# Altium schematic sheet ADC_Level.SchDoc
size A4
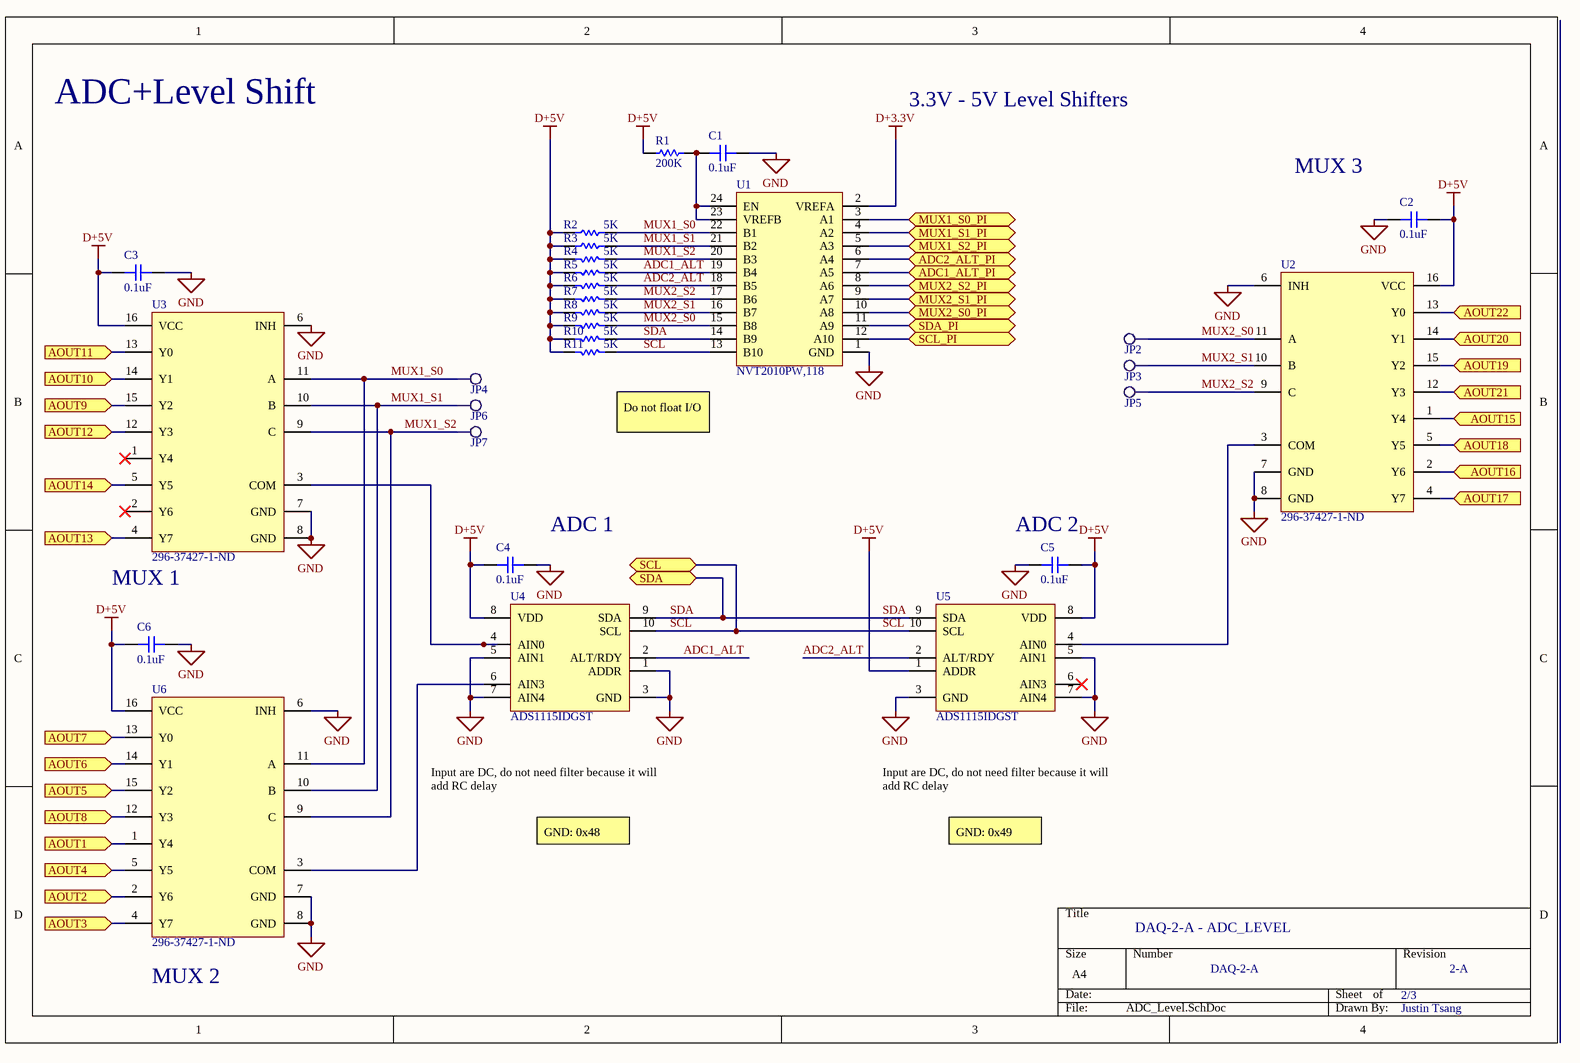
[diagram p0: ADC_Level.SchDoc]

## Parts
C1  0.1uF  [CAP-0603]
C2  0.1uF  [CAP-0603]
C3  0.1uF  [CAP-0603]
C4  0.1uF  [CAP-0603]
C5  0.1uF  [CAP-0603]
C6  0.1uF  [CAP-0603]
JP2  Testpoint2  [TP2]  (value not drawn)
JP3  Testpoint2  [TP2]  (value not drawn)
JP4  Testpoint2  [TP2]  (value not drawn)
JP5  Testpoint2  [TP2]  (value not drawn)
JP6  Testpoint2  [TP2]  (value not drawn)
JP7  Testpoint2  [TP2]  (value not drawn)
R1  200K  [RES-0603]
R2  5K  [RES-0603]
R3  5K  [RES-0603]
R4  5K  [RES-0603]
R5  5K  [RES-0603]
R6  5K  [RES-0603]
R7  5K  [RES-0603]
R8  5K  [RES-0603]
R9  5K  [RES-0603]
R10  5K  [RES-0603]
R11  5K  [RES-0603]
U1  NVT2010PW,118  [TSSOP65P660X110-24]
U2  296-37427-1-ND  [16-SOIC]
U3  296-37427-1-ND  [16-SOIC]
U4  ADS1115IDGST  [VSSOP50P310X310-10P]
U5  ADS1115IDGST  [VSSOP50P310X310-10P]
U6  296-37427-1-ND  [16-SOIC]

## Ports
ADC1_ALT_PI (bidir), ADC2_ALT_PI (bidir), AOUT1 (in), AOUT2 (in), AOUT3 (in), AOUT4 (in), AOUT5 (in), AOUT6 (in), AOUT7 (in), AOUT8 (in), AOUT9 (in), AOUT10 (in), AOUT11 (in), AOUT12 (in), AOUT13 (in), AOUT14 (in), AOUT15 (in), AOUT16 (in), AOUT17 (in), AOUT18 (in), AOUT19 (in), AOUT20 (in), AOUT21 (in), AOUT22 (in), MUX1_S0_PI (bidir), MUX1_S1_PI (bidir), MUX1_S2_PI (bidir), MUX2_S0_PI (bidir), MUX2_S1_PI (bidir), MUX2_S2_PI (bidir), SCL (bidir), SCL_PI (bidir), SDA (bidir), SDA_PI (bidir)

## Nets
D+3.3V: U1.2(VREFA)
D+5V: C2.2 C3.2 C4.2 C5.2 C6.2 R1.2 R2.1 R3.1 R4.1 R5.1 R6.1 R7.1 R8.1 R9.1 R10.2 R11.1 U2.16(VCC) U3.16(VCC) U4.8(VDD) U5.1(ADDR) U5.8(VDD) U6.16(VCC)
GND: C1.1 C2.1 C3.1 C4.1 C5.1 C6.1 U1.1(GND) U2.6(INH) U2.7(GND) U2.8(GND) U3.6(INH) U3.7(GND) U3.8(GND) U4.1(ADDR) U4.3(GND) U4.5(AIN1) U4.7(AIN4) U5.3(GND) U5.5(AIN1) U5.7(AIN4) U6.6(INH) U6.7(GND) U6.8(GND)
ADC1_ALT: R5.2 U1.19(B4) U4.2(ALT/RDY)
ADC1_ALT_PI: U1.7(A5) ; port ADC1_ALT_PI
ADC2_ALT: R6.2 U1.18(B5) U5.2(ALT/RDY)
ADC2_ALT_PI: U1.6(A4) ; port ADC2_ALT_PI
AOUT1: U6.1(Y4) ; port AOUT1
AOUT2: U6.2(Y6) ; port AOUT2
AOUT3: U6.4(Y7) ; port AOUT3
AOUT4: U6.5(Y5) ; port AOUT4
AOUT5: U6.15(Y2) ; port AOUT5
AOUT6: U6.14(Y1) ; port AOUT6
AOUT7: U6.13(Y0) ; port AOUT7
AOUT8: U6.12(Y3) ; port AOUT8
AOUT9: U3.15(Y2) ; port AOUT9
AOUT10: U3.14(Y1) ; port AOUT10
AOUT11: U3.13(Y0) ; port AOUT11
AOUT12: U3.12(Y3) ; port AOUT12
AOUT13: U3.4(Y7) ; port AOUT13
AOUT14: U3.5(Y5) ; port AOUT14
AOUT15: U2.1(Y4) ; port AOUT15
AOUT16: U2.2(Y6) ; port AOUT16
AOUT17: U2.4(Y7) ; port AOUT17
AOUT18: U2.5(Y5) ; port AOUT18
AOUT19: U2.15(Y2) ; port AOUT19
AOUT20: U2.14(Y1) ; port AOUT20
AOUT21: U2.12(Y3) ; port AOUT21
AOUT22: U2.13(Y0) ; port AOUT22
MUX1_S0: JP4.1 R2.2 U1.22(B1) U3.11(A) U6.11(A)
MUX1_S0_PI: U1.3(A1) ; port MUX1_S0_PI
MUX1_S1: JP6.1 R3.2 U1.21(B2) U3.10(B) U6.10(B)
MUX1_S1_PI: U1.4(A2) ; port MUX1_S1_PI
MUX1_S2: JP7.1 R4.2 U1.20(B3) U3.9(C) U6.9(C)
MUX1_S2_PI: U1.5(A3) ; port MUX1_S2_PI
MUX2_S0: JP2.1 R9.2 U1.15(B8) U2.11(A)
MUX2_S0_PI: U1.10(A8) ; port MUX2_S0_PI
MUX2_S1: JP3.1 R8.2 U1.16(B7) U2.10(B)
MUX2_S1_PI: U1.9(A7) ; port MUX2_S1_PI
MUX2_S2: JP5.1 R7.2 U1.17(B6) U2.9(C)
MUX2_S2_PI: U1.8(A6) ; port MUX2_S2_PI
SCL: R11.2 U1.13(B10) U4.10(SCL) U5.10(SCL) ; port SCL
SCL_PI: U1.12(A10) ; port SCL_PI
SDA: R10.1 U1.14(B9) U4.9(SDA) U5.9(SDA) ; port SDA
SDA_PI: U1.11(A9) ; port SDA_PI
NetC1_2: C1.2 R1.1 U1.23(VREFB) U1.24(EN)
NetU2_3: U2.3(COM) U5.4(AIN0)
NetU3_3: U3.3(COM) U4.4(AIN0)
NetU4_6: U4.6(AIN3) U6.3(COM)

Not connected (* = marked no-connect by the designer): U3 1(Y4)* 2(Y6)*; U5 6(AIN3)*

## Notes on the sheet
- ADC+Level Shift
- 3.3V - 5V Level Shifters
- MUX 3
- Do not float I/O
- (near U3) MUX 1
- (near C4) ADC 1
- (near C5) ADC 2
- Input are DC, do not need filter because it will add RC delay
- GND: 0x48
- GND: 0x49
- DAQ-2-A - ADC_LEVEL
- (near U6) MUX 2
- DAQ-2-A
- 2/3
- 2-A
- Justin Tsang

## Library data of the parts
C1-C6 = 0603-0.1uF-16V: CAP CER 0.1UF 16V X7R 0603; Manufacturer: KEMET; Manufacturer Part Number: C0603C104M4RACTU; Dielectric Material: Ceramic; Capacitance: 100nF; Tolerance: 20%; Supplier 1: Digi-Key; Stock 1: 254524; Pricing 1: 1=0.1, 10=0.036, 100=0.0161, 500=0.01152, 1000=0.00904 (USD); Mount: Surface Mount,PCB; Case/Package: 0603; Number of Pins: 2; Case Code (Metric): 1608; Case Code (Imperial): 0603; Min Operating Temperature: -55°C; Max Operating Temperature: 125°C; Package Quantity: 1; Voltage Rating: 16V; Packaging: Tape and Reel; Voltage Rating (DC): 16V; Dielectric: X7R; Termination: SMD/SMT; Length: 1.6mm; Height: 0.8mm; Width: 0.031inch; Thickness: 0.034inch; Lead Pitch: 0.7mm; Depth: 0.8mm; Radiation Hardening: No; REACH SVHC: No SVHC; ComponentLink1URL: https://www.verical.com/server-webapp/html/getDatasheet?partID=66190&src-supplier=Verical; ComponentLink1Description: https://www.verical.com/server-webapp/html/getDatasheet?partID=66190&src-supplier=Verical; ComponentLink2URL: http://www.farnell.com/datasheets/2746055.pdf?src-supplier=Element14; ComponentLink2Description: http://www.farnell.com/datasheets/2746055.pdf?src-supplier=Element14; ComponentLink3URL: http://www.farnell.com/datasheets/2123765.pdf?src-supplier=Element14; ComponentLink3Description: http://www.farnell.com/datasheets/2123765.pdf?src-supplier=Element14; ComponentLink4URL: http://www.alliedelec.com/m/d/9bfe7773041ffe9d406e68bc7b377fdd.pdf?src-supplier=Allied+Electronics; ComponentLink4Description: http://www.alliedelec.com/m/d/9bfe7773041ffe9d406e68bc7b377fdd.pdf?src-supplier=Allied+Electronics; ComponentLink5URL: https://www.verical.com/server-webapp/html/getDatasheet?partID=302288&src-supplier=Verical; ComponentLink5Description: https://www.verical.com/server-webapp/html/getDatasheet?partID=302288&src-supplier=Verical; Supplier Part Number 1: 399-1099-6-ND
JP2-JP7 = Testpoint2: Single layer pad TP
R1 = 0603-200KR: RES SMD 200K OHM 1% 1/10W 0603; Supplier 1: Digi-Key; Supplier Part Number 1: RMCF0603FT200KCT-ND
R2-R11 = 0603-5KR: RES SMD 4.99K OHM 1% 1/10W 0603; Manufacturer: Bourns; Manufacturer Part Number: CR0603-FX-4991ELF; Resistance: 4.99kR; Power Rating: 100mW; Voltage Rating: 50V; Temperature Coefficient: 100ppm/°C; Supplier 1: Digi-Key; Stock 1: 70557; Pricing 1: 1=0.1, 10=0.02, 25=0.0144, 50=0.011, 100=0.0082, 250=0.00624, 500=0.00498, 1000=0.00367 (USD); Mount: Surface Mount; Case/Package: 0603; Case Code (Imperial): 0603; Case Code (Metric): 1608; Contact Plating: Tin; Min Operating Temperature: -55°C; Max Operating Temperature: 155°C; Tolerance: 1%; Packaging: Tape and Reel; Package Quantity: 1; Composition: Thick Film; Termination: SMD/SMT; Number of Terminations: 2; Max Power Dissipation: 100mW; Features: Moisture Resistant; Length: 0.063inch; Height: 0.022inch; Width: 0.8mm; Thickness: 457um; Radiation Hardening: No; ComponentLink1URL: https://www.bourns.com/docs/Product-Datasheets/CHPREZTR.pdf?src-supplier=Digi-Key; ComponentLink1Description: https://www.bourns.com/docs/Product-Datasheets/CHPREZTR.pdf?src-supplier=Digi-Key; ComponentLink2URL: http://www.bourns.com/pdfs/chpreztr.pdf?src-supplier=Avnet; ComponentLink2Description: http://www.bourns.com/pdfs/chpreztr.pdf?src-supplier=Avnet; Supplier Part Number 1: CR0603-FX-4991ELFDKR-ND
U1 = IC_NVT2010PW: NVT2010PW/TSSOP24/REEL13//; Manufacturer: NXP Semiconductors; Max Supply Voltage: 5.5V; Min Supply Voltage: 1V; Number of Channels: 10; Propagation Delay: 1.5ns; Logic Function: Translator; Output Type: Voltage; Supplier 1: Digi-Key; Manufacturer Part Number: NVT2010PW,118; RoHS: Yes; Category: Interface ICs; Stock 1: 3117; Pricing 1: 1=1.02000, 10=0.91600, 25=0.86920, 100=0.83480 (USD); Mount: Surface Mount; Case/Package: TSSOP; Number of Pins: 24; Min Operating Temperature: -40°C; Max Operating Temperature: 85°C; Packaging: Tape and Reel; Package Quantity: 1; Number of Bits: 10; Turn-On Delay Time: 1.5ns; Series: -; Radiation Hardening: No; Lead Free: Lead Free; RoHS Compliant: Yes; ComponentLink1URL: https://datasheet.ciiva.com/1899/nvt2008-nvt2010-1899186.pdf?src-supplier=Digi-Key; ComponentLink1Description: https://datasheet.ciiva.com/1899/nvt2008-nvt2010-1899186.pdf?src-supplier=Digi-Key; ComponentLink2URL: https://datasheet.ciiva.com/1899/nvt2008-nvt2010-1899187.pdf?src-supplier=Digi-Key; ComponentLink2Description: https://datasheet.ciiva.com/1899/nvt2008-nvt2010-1899187.pdf?src-supplier=Digi-Key; ComponentLink3URL: https://datasheet.ciiva.com/8244/nvt2008-nvt2010-8244294.pdf?src-supplier=Avnet; ComponentLink3Description: https://datasheet.ciiva.com/8244/nvt2008-nvt2010-8244294.pdf?src-supplier=Avnet; ComponentLink4URL: https://datasheet.ciiva.com/1899/nvt2008-nvt2010-1899185.pdf?src-supplier=Digi-Key; ComponentLink4Description: https://datasheet.ciiva.com/1899/nvt2008-nvt2010-1899185.pdf?src-supplier=Digi-Key; Supplier Part Number 1: 568-5299-1-ND
U2 U3 U6 = MUX-SN74LV4051ATDWRQ1: IC MUX/DEMUX 8X1 16SOIC; Manufacturer: Texas Instruments; Max Supply Voltage: 5.5V; Min Supply Voltage: 2V; Bandwidth: 35MHz; Propagation Delay: 7ns; Number of Inputs: 8; Number of Outputs: 1; Logic Function: Multiplexer,Demultiplexer; On-State Resistance: 75R; Operating Supply Current: 20uA; Turn-On Delay Time: 20ns; Supply Type: Single; Supplier 1: Digi-Key; Manufacturer Part Number: SN74LV4051ATDWRQ1; Stock 1: 2359; Pricing 1: 1=0.7, 10=0.617, 25=0.5796, 100=0.4731, 250=0.43944, 500=0.374, 1000=0.2992 (USD); Mount: Surface Mount; Case/Package: SOIC; Number of Pins: 16; Weight: 0.014829oz; Min Operating Temperature: -40°C; Max Operating Temperature: 105°C; Packaging: Tape and Reel; Package Quantity: 2000; Number of Channels: 1; Turn-Off Delay Time: 20ns; Number of Circuits: 1; -3db Bandwidth: 35MHz; Number of Bits: 8; Radiation Hardening: No; Lead Free: Lead Free; ComponentLink1URL: https://www.verical.com/server-webapp/html/getDatasheet?partID=348177&src-supplier=Verical; ComponentLink1Description: https://www.verical.com/server-webapp/html/getDatasheet?partID=348177&src-supplier=Verical; ComponentLink2URL: http://focus.ti.com/lit/ds/symlink/sn74lv4051a-q1.pdf?src-supplier=Avnet; ComponentLink2Description: http://focus.ti.com/lit/ds/symlink/sn74lv4051a-q1.pdf?src-supplier=Avnet; ComponentLink3URL: http://www.ti.com/lit/ds/symlink/sn74lv4051a-q1.pdf?src-supplier=Digi-Key; ComponentLink3Description: http://www.ti.com/lit/ds/symlink/sn74lv4051a-q1.pdf?src-supplier=Digi-Key; Supplier Part Number 1: 296-37427-6-ND
U4 U5 = IC_ADS1115: TEXAS INSTRUMENTS - ADS1115IDGST . - Analogue to Digital Converter, 16 bit, 860 SPS, Differential, Single Ended, I2C, Single, 2 V; Sampling Rate: 860S/s; Number of A/D Converters: 1; Number of Bits: 16; Resolution: 16b; Polarity: Bipolar; Number of Inputs: 4; Min Supply Voltage: 2V; Max Supply Voltage: 5.5V; Conversion Rate: 0.86KS/s; Integral Nonlinearity (INL): 1LSB; Power Dissipation: 900uW; Supplier 1: Digi-Key; Manufacturer: Texas Instruments; RoHS: Yes; Category: Analog to Digital Converters (ADCs); Stock 1: 7435; Pricing 1: 1=5.62000, 10=5.04600, 25=4.77000, 100=3.92200, 250=3.51920, 500=3.39200, 1000=2.81960 (USD); Case/Package: VSSOP; Number of Pins: 10; Contact Plating: Gold; Min Operating Temperature: -40°C; Max Operating Temperature: 125°C; Interface: I2C; Package Quantity: 2500; Packaging: Tape and Reel; Supply Type: Single; Number of Converters: 1; Max Supply Voltage (DC): 5.5V; Min Supply Voltage (DC): 2V; Series: -; Radiation Hardening: No; RoHS Compliant: Yes; Lead Free: Lead Free; REACH SVHC: No SVHC; ComponentLink1URL: https://datasheet.ciiva.com/4031/47725463s8438921n7713-4031028.pdf?src-supplier=Arrow+Electronics; ComponentLink1Description: https://datasheet.ciiva.com/4031/47725463s8438921n7713-4031028.pdf?src-supplier=Arrow+Electronics; ComponentLink2URL: https://datasheet.ciiva.com/1304/ads1113-1304266.pdf?src-supplier=Digi-Key; ComponentLink2Description: https://datasheet.ciiva.com/1304/ads1113-1304266.pdf?src-supplier=Digi-Key; ComponentLink3URL: https://datasheet.ciiva.com/25993/sbas444b-25993205.pdf?src-supplier=Avnet+Europe; ComponentLink3Description: https://datasheet.ciiva.com/25993/sbas444b-25993205.pdf?src-supplier=Avnet+Europe; Manufacturer Part Number: ADS1115IDGST; Supplier Part Number 1: 296-24934-1-ND